# EAGLE design 09B-11 (EAGLE 6.3)
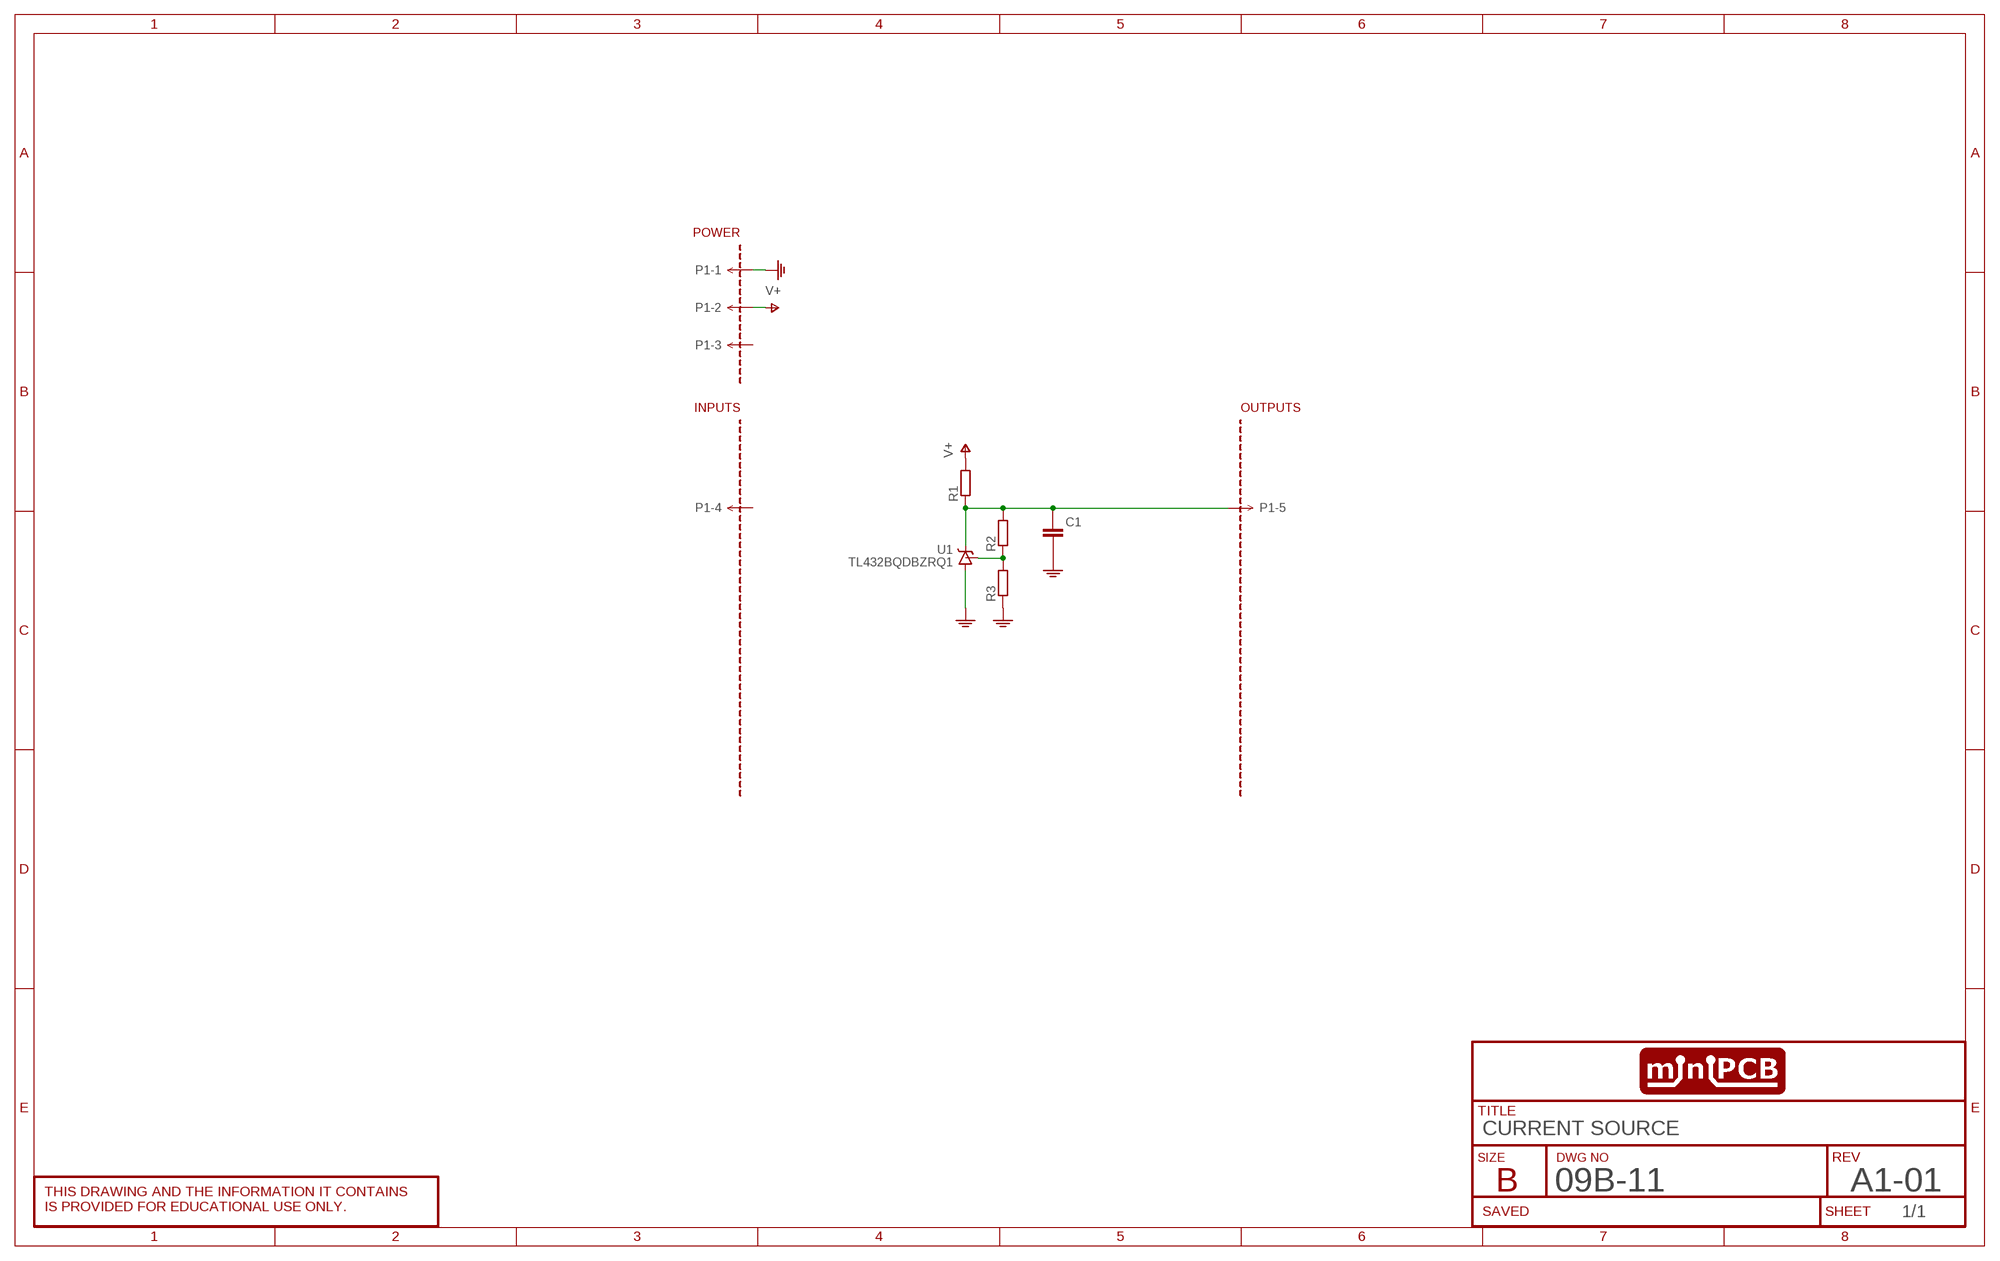
[diagram p0: schematic, sheet 1]
SHEET1 (SCHEMATIC): DWG_NO: 09B-11; REV: A1-01; TITLE: CURRENT SOURCE

## Parts
C1  CAPACITORSMD  [C0805]
P1  MINIPCB_5P5P  [PINS_1X5]
PCB1  MINIPCB_0PPCB20-20  [PCB20-20]
R1  RESISTORSMD  [R0805]
R2  RESISTORSMD  [R0805]
R3  RESISTORSMD  [R0805]
U1  TL432BQDBZRQ1  [SOT95P237X112-3N]

## Nets
GND: C1.2ASDF(-) P1.1 R3.1 U1.3(A)
N$1: C1.1ASD(+) P1.5 R1.1 R2.2 U1.1(C)
N$2: R2.1 R3.2 U1.2(REF)
V+: P1.2 R1.2
Unconnected: P1.3 P1.4

## Library data of the parts
C1 = minipcb:CAPACITOR
P1 = minipcb:MINIPCB_5P
PCB1 = minipcb:MINIPCB_0P; PART_NUMBER: 09B-11; REVISION: A1-01; TITLE: TL432-EVAL
R1-R3 = minipcb:RESISTOR
U1 = minipcb:TL432BQDBZRQ1: ADJUSTABLE PRECISION SHUNT REGULATORS Check availability <https://pricing.snapeda.com/parts/TL432BQDBZRQ1/Texas%20Instruments/view-part?ref=eda>; AVAILABILITY: In Stock; CHECK_PRICES: https://www.snapeda.com/parts/TL432BQDBZRQ1/Texas+Instruments/view-part/?ref=eda; DESCRIPTION: Automotive adjustable precision shunt regulator (pin layout: RKA); MF: Texas Instruments; MP: TL432BQDBZRQ1; PACKAGE: SOT-23-3 Texas Instruments; PRICE: None; SNAPEDA_LINK: https://www.snapeda.com/parts/TL432BQDBZRQ1/Texas+Instruments/view-part/?ref=snap

## Board
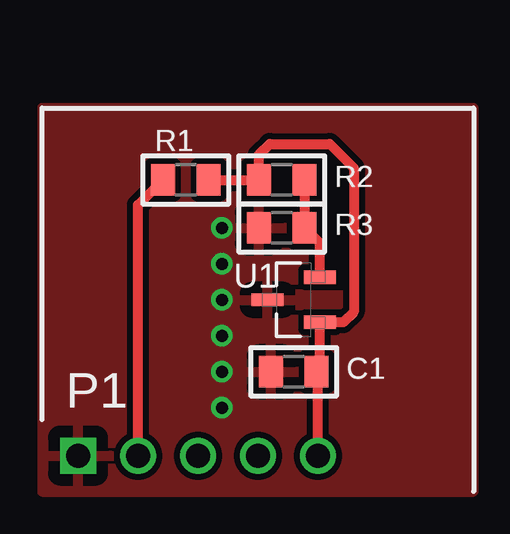
[diagram p1: board, top side]
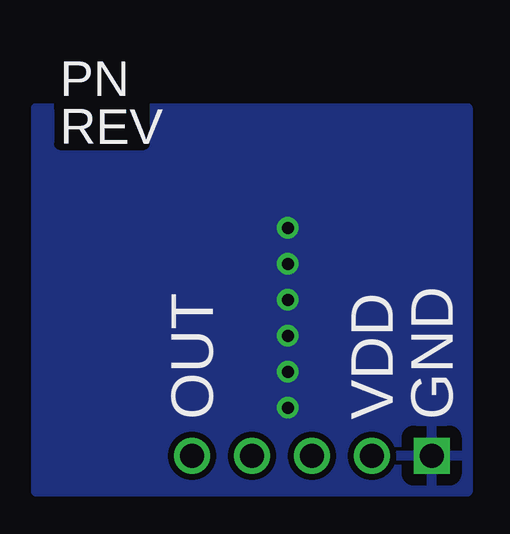
[diagram p2: board, bottom side, seen from below]

No outline drawn. Coordinates in mm, seen from the top.
Copper layers (1*16): Top 0.035mm / dielectric 1.5mm / Bottom 0.035mm
Design rules "minipcb": minimum track width 0.2mm, minimum drill 0.5mm, track to track 0.25mm, track to pad 0.5mm, pad to pad 0.5mm, via to via 0.5mm, smd to smd 0.15mm, copper to edge 1mm, drill to drill 1mm, minimum pad ring 0.2mm, minimum via ring 0.2mm, stop-mask expansion 0.1mm, vias tented up to drill 0.6mm, thermal gap 0.5mm

### Footprints (pad centres in the part's own frame; a part is rotated, then mirrored left to right if it is on the bottom)
C0805 = smd 1 x 1.3: 1ASD -0.95,0; 2ASDF 0.95,0
PINS_1X5 = drill 1 square: 1 0,0 | drill 1: 2 2.5,0; 3 5,0; 4 7.5,0; 5 10,0
R0805 = smd 1 x 1.3: 1 -0.95,0; 2 0.95,0
SOT95P237X112-3N = smd 1.321 x 0.559: 1 -1.092,0.94; 2 -1.092,-0.94 | smd 1.321 x 0.508: 3 1.092,0

### Placement (x,y rotation side)
C1  11.5,6 180 top
P1  2.5,2.5 0 top
PCB1  0,0 0 top
R1  7,14 180 top
R2  11,14 180 top
R3  11,12 0 top
U1  11.5,9 180 top

### Tracks (layer width: path | path; a pad name or v marks a point on that pad's centre or on a via)
GND  (via drill 0.5)
  other vias: 8.5,12 8.5,9 8.5,6 8.5,7.5 8.5,4.5 8.5,10.5
  pour Bottom: 1,1 19,1 19,17 1,17
  pour Top: 1,1 19,1 19,17 1,17
N$1
  Top 0.406: R1.1 R2.2 10.05,15.05 10.5,15.5 13,15.5 14,14.5 14,8.5 13.56,8.06 U1.1 12.59,6.14 C1.1ASD arc-90 12.5,5.95 P1.5
N$2
  Top 0.406: R2.1 R3.2 12.59,11.36 U1.2
V+
  Top 0.406: P1.2 5,12.95 R1.2

### Text on the board
bPlace: GND | VDD | OUT
_tNames: R1 | R2 | R3 | U1 | C1